# EAGLE design somfyOw_shape_v2 (EAGLE 6.5.0)
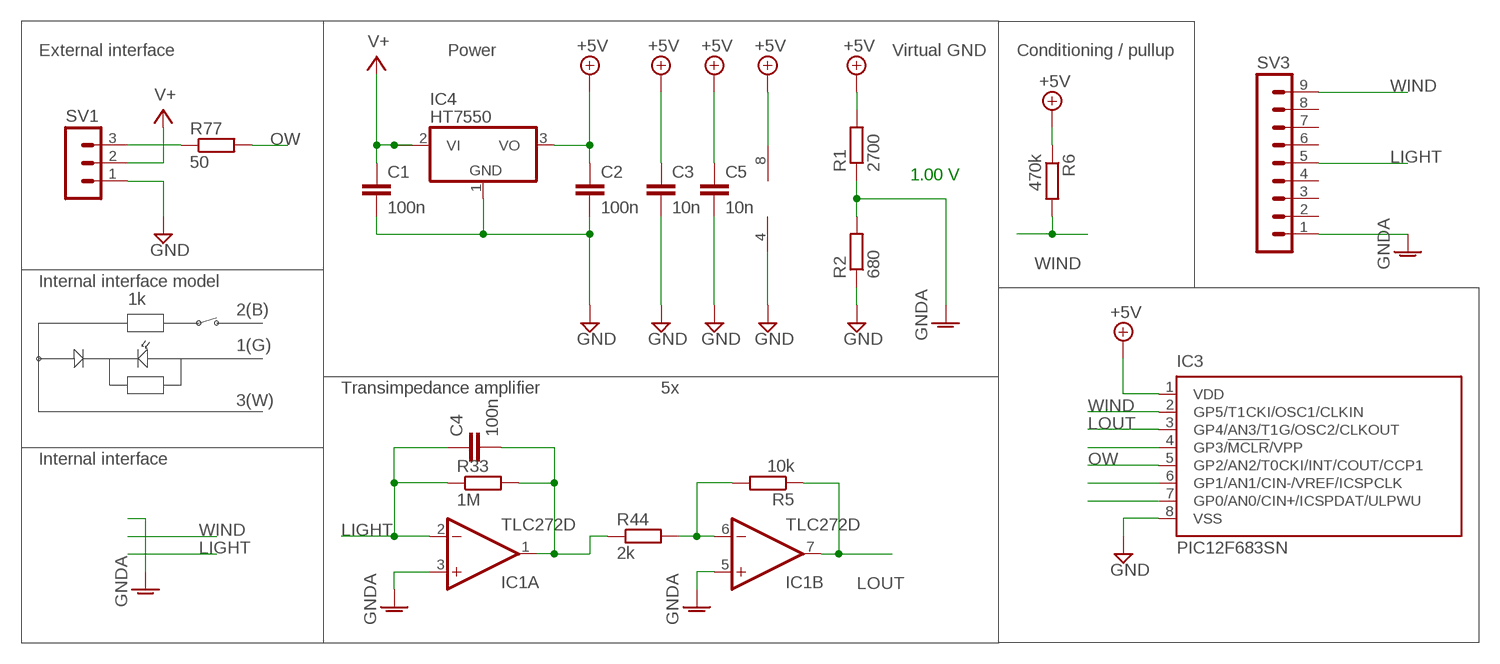
[diagram p0: schematic, sheet 1]

## Parts
C1  100n  C-EUC1206  [C1206]
C2  100n  C-EUC1206  [C1206]
C3  10n  C-EUC1206  [C1206]
C4  100n  C-EUC1206  [C1206]
C5  10n  C-EUC1206  [C1206]
IC1  TLC272D  [SO08]
IC3  PIC12F683SN  [SO-08]
IC4  HT7550  MCP170312MB  [SOT89]
R1  2700  R-EU_M1206  [M1206]
R2  680  R-EU_M1206  [M1206]
R5  10k  R-EU_M1206  [M1206]
R6  470k  R-EU_M1206  [M1206]
R33  1M  R-EU_R1206  [R1206]
R44  2k  R-EU_R1206  [R1206]
R77  50  R-EU_R1206  [R1206]
SV1  MA03-1  [MA03-1]
SV3  MA09-1W  [MA09-1W]

## Nets
+5V: C2.1 C3.1 C5.1 IC1.8(P:V+) IC3.1(VDD) IC4.3(VO) R1.2 R6.1
GND: C1.2 C2.2 C3.2 C5.2 IC1.4(P:V-) IC3.8(VSS) IC4.1(GND) R2.1 SV1.1
GNDA: IC1.3(A:+IN) IC1.5(B:+IN) R1.1 R2.2 SV3.1
LIGHT: C4.1 IC1.2(A:-IN) R33.1 SV3.5
LOUT: IC1.7(B:OUT) IC3.3(GP4/AN3/T1G/OSC2/CLKOUT) R5.1
N$1: R77.1 SV1.3
N$2: C4.2 IC1.1(A:OUT) R33.2 R44.1
N$3: IC1.6(B:-IN) R5.2 R44.2
N$4: IC3.4(GP3/!MCLR!/VPP)
N$5: IC3.6(GP1/AN1/CIN-/VREF/ICSPCLK)
N$6: IC3.7(GP0/AN0/CIN+/ICSPDAT/ULPWU)
OW: IC3.5(GP2/AN2/T0CKI/INT/COUT/CCP1) R77.2
V+: C1.1 IC4.2(VI) IC4.2@1(VI1) SV1.2
WIND: IC3.2(GP5/T1CKI/OSC1/CLKIN) R6.2 SV3.9
Unconnected: SV3.2 SV3.3 SV3.4 SV3.6 SV3.7 SV3.8

## Notes on the sheet
- External interface | Power | Virtual GND | Conditioning / pullup
- 1.00 V
- Internal interface model
- 1k
- 2(B)
- 1(G)
- Transimpedance amplifier | 5x
- 3(W)
- Internal interface

## Library data of the parts
C1-C5 = rcl:C-EU: CAPACITOR, European symbol
IC1 = linear:TLC272: OP AMP
IC3 = microchip:PIC12F683: 8-Pin Flash-Based, 8-Bit CMOS Microcontrollers with nanoWatt Technology Source: http://ww1.microchip.com/downloads/en/DeviceDoc/41211D_.pdf; MF: MICROCHIP; MPN: PIC12F683-I/SN; OC_FARNELL: 9759042; OC_NEWARK: 61K3434
IC4 = linear:MCP1703*: 250 mA, 16V, Low Quiescent Current LDO Regulator Source: http://ww1.microchip.com/downloads/en/DeviceDoc/22049b.pdf
R1 R2 R5 R6 R33 R44 R77 = rcl:R-EU_: RESISTOR, European symbol
SV1 = con-lstb:MA03-1: PIN HEADER; OC_FARNELL: unknown; OC_NEWARK: unknown
SV3 = con-lstb:MA09-1W: PIN HEADER; OC_FARNELL: unknown; OC_NEWARK: unknown

## Board
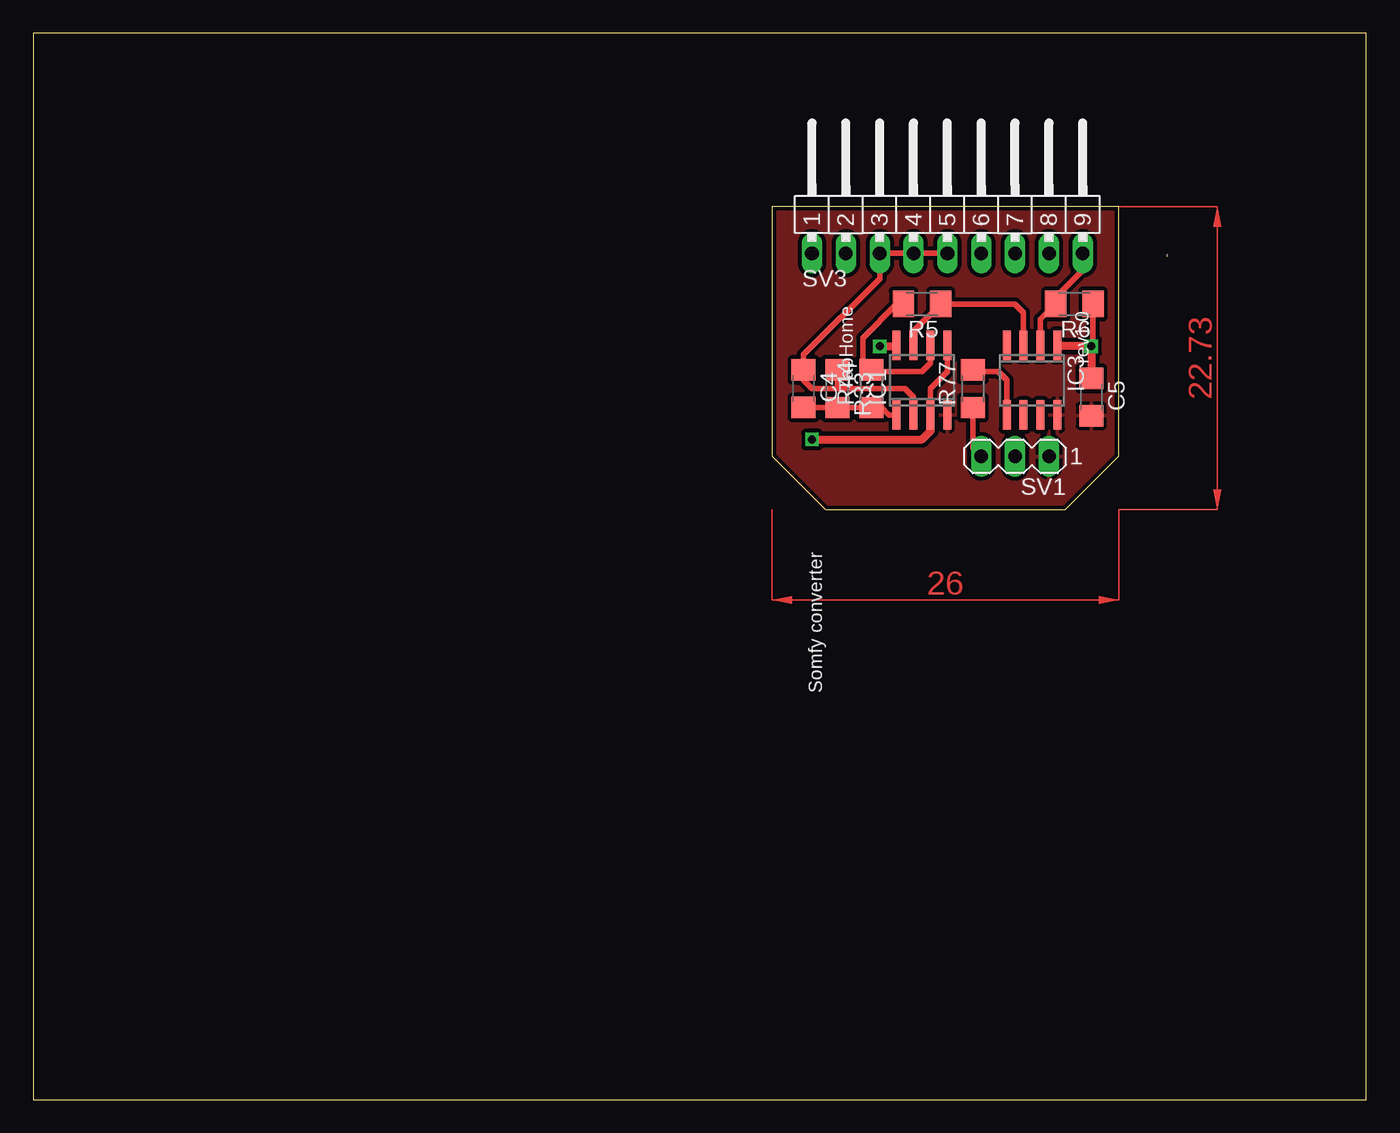
[diagram p1: board, top side]
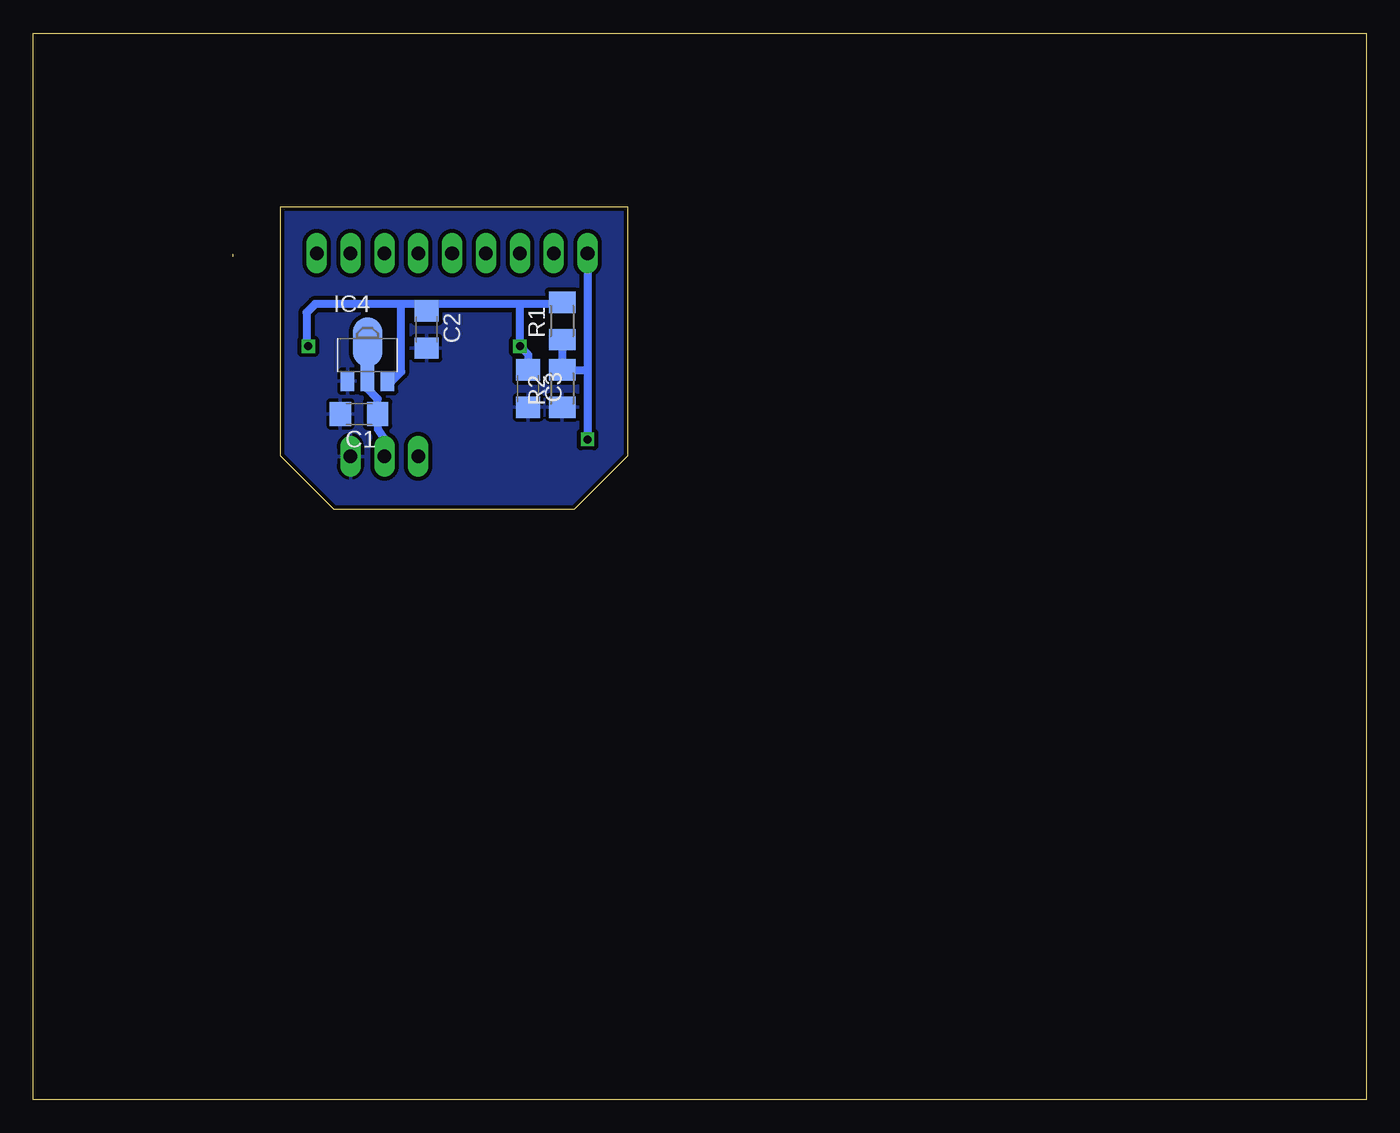
[diagram p2: board, bottom side, seen from below]

Size 100 x 80 mm. Coordinates in mm from the lower left corner, seen from the top.
Outline: 85.03,63.44 85.03,63.24
Outline: 0,0 100,0 100,80 0,80 0,0
Outline: 81.43,67 55.43,67 55.43,48.27 59.43,44.27 77.43,44.27 81.43,48.27 81.43,67
Copper layers (1*16): Top 0.035mm / dielectric 1.5mm / Bottom 0.035mm
Design rules "default *": minimum track width 10mil, minimum drill 24mil, track to track 8mil, track to pad 8mil, pad to pad 8mil, via to via 8mil, smd to smd 8mil, copper to edge 10mil, drill to drill 8mil, minimum pad ring 10mil, minimum via ring 8mil, stop-mask expansion 4mil, vias tented up to drill 0mil, thermal gap 10mil

### Footprints (pad centres in the part's own frame; a part is rotated, then mirrored left to right if it is on the bottom)
C1206 = smd 1.6 x 1.8: 1 -1.4,0; 2 1.4,0
SO08 = smd 0.6 x 2.2: 1 -1.905,-2.6; 2 -0.635,-2.6; 3 0.635,-2.6; 4 1.905,-2.6; 5 1.905,2.6; 6 0.635,2.6; 7 -0.635,2.6; 8 -1.905,2.6
SO-08 = smd 0.6 x 2.2: 1 -1.905,-2.6; 2 -0.635,-2.6; 3 0.635,-2.6; 4 1.905,-2.6; 5 1.905,2.6; 6 0.635,2.6; 7 -0.635,2.6; 8 -1.905,2.6
SOT89 = smd 1 x 1.5: 1 -1.499,-1.981; 3 1.499,-1.981 | smd 1 x 2: 2 0,-1.727 | smd 2.2 x 3.7: 2@1 0,0.94
M1206 = smd 1.6 x 2: 1 -1.4,0; 2 1.4,0
R1206 = smd 1.6 x 1.803: 1 -1.422,0; 2 1.422,0
MA03-1 = drill 1.016 long: 1 -2.54,0; 2 0,0; 3 2.54,0
MA09-1W = drill 1.016 long: 1 -10.16,0; 2 -7.62,0; 3 -5.08,0; 4 -2.54,0; 5 0,0; 6 2.54,0; 7 5.08,0; 8 7.62,0; 9 10.16,0

### Placement (x,y rotation side)
C1  75.56,51.44 180 bottom
C2  70.48,57.78 270 bottom
C3  62.87,53.34 270 bottom
C4  57.78,53.34 270 top
C5  79.38,52.7 270 top
IC1  66.67,53.98 0 top
IC3  74.93,53.98 180 top
IC4  74.93,55.88 0 bottom
R1  60.33,58.42 90 bottom
R2  60.33,53.34 90 bottom
R5  66.67,59.69 180 top
R6  78.11,59.69 180 top
R33  60.33,53.34 270 top
R44  62.87,53.34 90 top
R77  70.48,53.34 90 top
SV1  73.66,48.26 180 top
SV3  68.58,63.5 0 top

### Tracks (layer width: path | path; a pad name or v marks a point on that pad's centre or on a via)
+5V  (via drill 0.6)
  Top 0.406: 64.77,57.15 IC1.8 64.71,56.52 | R6.1 79.5,56.65 v79.38,56.52 | 76.89,56.52 IC3.1
  Top 0.61: v63.5,56.52 64.71,56.52 | 76.89,56.52 v79.38,56.52 C5.1
  Bottom 0.406: 79.5,56.65 v79.38,56.52 | 60.45,59.69 R1.2 | 71.12,59.69 70.99,59.69 C2.1
  Bottom 0.61: C3.1 62.87,55.88 v63.5,56.52 63.5,59.69 | 60.45,59.69 63.5,59.69 | 63.5,59.69 71.12,59.69 72.39,59.69 | 72.39,59.69 78.87,59.69 79.5,59.05 79.5,56.65 | IC4.3 73.1,53.9 72.39,54.61 72.39,59.69
GND
  Bottom 0.406: 77.47,52.07 77.47,50.8 76.97,51.3 C1.2
  Bottom 0.61: 76.2,53.67 IC4.1
  pour Top (isolate 0.305): 55.68,66.75 55.68,48.27 59.43,44.52 77.43,44.52 81.18,48.27 81.18,66.75
  pour Bottom (isolate 0.305): 55.43,67 55.43,48.27 59.43,44.27 77.43,44.27 81.43,48.27 81.43,67
GNDA  (via drill 0.6)
  Top 0.406: IC1.3 67.31,53.34 68.58,54.61 IC1.5
  Top 0.61: v58.42,49.53 66.67,49.53 67.31,50.16 IC1.3
  Bottom 0.406: 58.55,54.74 58.42,54.61
  Bottom 0.61: SV3.1 58.42,54.61 v58.42,49.53 | R1.1 R2.2 58.55,54.74
LIGHT
  Top 0.406: IC1.2 66.04,52.7 65.41,53.34 60.33,53.34 | 60.33,53.34 58.42,53.34 57.78,53.98 C4.1 57.78,55.88 63.5,61.59 63.5,63.5 SV3.5 | R33.1 60.33,53.34
LOUT
  Top 0.406: IC1.7 66.04,57.66 R5.1 73.66,59.69 74.3,59.05 IC3.3
N$1
  Top 0.406: R77.1 70.48,48.9 SV1.3
N$2
  Top 0.406: IC1.1 64.19,51.38 63.5,52.07 63.02,52.07 R44.1 R33.2 57.81,51.92 C4.2
N$3
  Top 0.406: IC1.6 67.31,55.24 66.67,54.61 63.02,54.61 R44.2 62.23,55.4 62.23,57.15 64.77,59.69 R5.2
OW
  Top 0.406: IC3.5 73.03,53.98 72.39,54.61 70.64,54.61 R77.2
V+
  Bottom 0.406: 75.11,54.1 75.04,54.62 74.93,54.51 IC4.2 | 74.93,53.34 IC4.2 | IC4.2@1 IC4.2
  Bottom 0.61: 74.93,53.34 74.17,52.58 C1.1 74.17,50.3 73.66,49.53 SV1.2
WIND
  Top 0.406: IC3.2 75.56,58.55 R6.2 76.7,60.2 78.74,62.23 SV3.9
(copper drawn outside any net)
  shapes: Top area x2

### Text on the board
tNames: rev1.0 | TapHome | Somfy converter